# EAGLE design turntable_ir_5 (EAGLE 8.3.1)
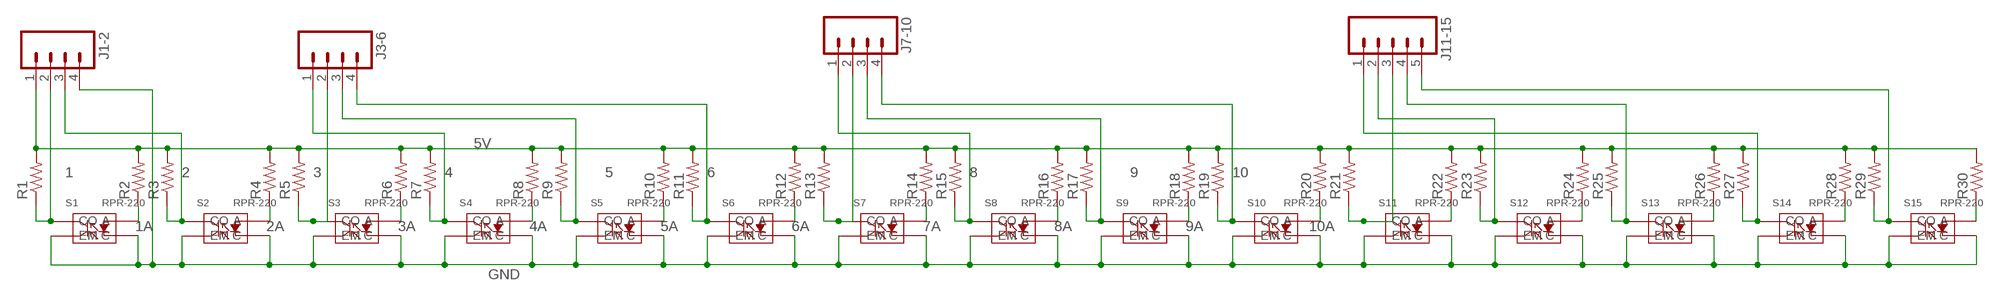
[diagram p0: schematic, sheet 1]

## Parts
J1-2  M04NO_SILK_ALL_ROUND  [1X04_NO_SILK_ALL_ROUND]
J3-6  M04NO_SILK_ALL_ROUND  [1X04_NO_SILK_ALL_ROUND]
J7-10  M04NO_SILK_ALL_ROUND  [1X04_NO_SILK_ALL_ROUND]
J11-15  M05NO_SILK  [1X05_NO_SILK]
R1  RESISTOR1206  [1206]
R2  RESISTOR1206  [1206]
R3  RESISTOR1206  [1206]
R4  RESISTOR1206  [1206]
R5  RESISTOR1206  [1206]
R6  RESISTOR1206  [1206]
R7  RESISTOR1206  [1206]
R8  RESISTOR1206  [1206]
R9  RESISTOR1206  [1206]
R10  RESISTOR1206  [1206]
R11  RESISTOR1206  [1206]
R12  RESISTOR1206  [1206]
R13  RESISTOR1206  [1206]
R14  RESISTOR1206  [1206]
R15  RESISTOR1206  [1206]
R16  RESISTOR1206  [1206]
R17  RESISTOR1206  [1206]
R18  RESISTOR1206  [1206]
R19  RESISTOR1206  [1206]
R20  RESISTOR1206  [1206]
R21  RESISTOR1206  [1206]
R22  RESISTOR1206  [1206]
R23  RESISTOR1206  [1206]
R24  RESISTOR1206  [1206]
R25  RESISTOR1206  [1206]
R26  RESISTOR1206  [1206]
R27  RESISTOR1206  [1206]
R28  RESISTOR1206  [1206]
R29  RESISTOR1206  [1206]
R30  RESISTOR1206  [1206]
S1  RPR-220  [RPR-220-6.4X4.9X6.5]
S2  RPR-220  [RPR-220-6.4X4.9X6.5]
S3  RPR-220  [RPR-220-6.4X4.9X6.5]
S4  RPR-220  [RPR-220-6.4X4.9X6.5]
S5  RPR-220  [RPR-220-6.4X4.9X6.5]
S6  RPR-220  [RPR-220-6.4X4.9X6.5]
S7  RPR-220  [RPR-220-6.4X4.9X6.5]
S8  RPR-220  [RPR-220-6.4X4.9X6.5]
S9  RPR-220  [RPR-220-6.4X4.9X6.5]
S10  RPR-220  [RPR-220-6.4X4.9X6.5]
S11  RPR-220  [RPR-220-6.4X4.9X6.5]
S12  RPR-220  [RPR-220-6.4X4.9X6.5]
S13  RPR-220  [RPR-220-6.4X4.9X6.5]
S14  RPR-220  [RPR-220-6.4X4.9X6.5]
S15  RPR-220  [RPR-220-6.4X4.9X6.5]

## Nets
1: J1-2.2 R1.1 S1.P$4(CO)
1A: R2.1 S1.P$1(A)
2: J1-2.3 R3.1 S2.P$4(CO)
2A: R4.1 S2.P$1(A)
3: J3-6.2 R5.1 S3.P$4(CO)
3A: R6.1 S3.P$1(A)
4: J3-6.1 R7.1 S4.P$4(CO)
4A: R8.1 S4.P$1(A)
5: J3-6.3 R9.1 S5.P$4(CO)
5A: R10.1 S5.P$1(A)
5V: J1-2.1 R1.2 R2.2 R3.2 R4.2 R5.2 R6.2 R7.2 R8.2 R9.2 R10.2 R11.2 R12.2 R13.2 R14.2 R15.2 R16.2 R17.2 R18.2 R19.2 R20.2 R21.2 R22.2 R23.2 R24.2 R25.2 R26.2 R27.2 R28.2 R29.2 R30.2
6: J3-6.4 R11.1 S6.P$4(CO)
6A: R12.1 S6.P$1(A)
7: J7-10.2 R13.1 S7.P$4(CO)
7A: R14.1 S7.P$1(A)
8: J7-10.1 R15.1 S8.P$4(CO)
8A: R16.1 S8.P$1(A)
9: J7-10.3 R17.1 S9.P$4(CO)
9A: R18.1 S9.P$1(A)
10: J7-10.4 R19.1 S10.P$4(CO)
10A: R20.1 S10.P$1(A)
11: J11-15.3 R21.1 S11.P$4(CO)
11A: R22.1 S11.P$1(A)
12: J11-15.2 R23.1 S12.P$4(CO)
12A: R24.1 S12.P$1(A)
13: J11-15.4 R25.1 S13.P$4(CO)
13A: R26.1 S13.P$1(A)
14: J11-15.1 R27.1 S14.P$4(CO)
14A: R28.1 S14.P$1(A)
15: J11-15.5 R29.1 S15.P$4(CO)
15A: R30.1 S15.P$1(A)
GND: J1-2.4 S1.P$2(C) S1.P$3(EM) S2.P$2(C) S2.P$3(EM) S3.P$2(C) S3.P$3(EM) S4.P$2(C) S4.P$3(EM) S5.P$2(C) S5.P$3(EM) S6.P$2(C) S6.P$3(EM) S7.P$2(C) S7.P$3(EM) S8.P$2(C) S8.P$3(EM) S9.P$2(C) S9.P$3(EM) S10.P$2(C) S10.P$3(EM) S11.P$2(C) S11.P$3(EM) S12.P$2(C) S12.P$3(EM) S13.P$2(C) S13.P$3(EM) S14.P$2(C) S14.P$3(EM) S15.P$2(C) S15.P$3(EM)

## Library data of the parts
J1-2 J3-6 J7-10 = SparkFun-Connectors:M04: Header 4 Standard 4-pin 0.1" header. Use with straight break away headers (SKU : PRT-00116), right angle break away headers (PRT-00553), swiss pins (PRT-00743), machine pins (PRT-00117), and female headers (PRT-00115). Molex polarized connector foot print use with SKU : PRT-08231 with associated crimp pins and housings. 1MM SMD Version SKU: PRT-10208; PROD_ID: CONN-09696
J11-15 = SparkFun-Connectors:M05: Header 5 Standard 5-pin 0.1" header. Use with straight break away headers (SKU : PRT-00116), right angle break away headers (PRT-00553), swiss pins (PRT-00743), machine pins (PRT-00117), and female headers (PRT-00115). Molex polarized connector foot print use with SKU : PRT-08230 with associated crimp pins and housings.
R1-R30 = SparkFun-Resistors:RESISTOR: Resistor Basic schematic elements and footprints for 0603, 1206, and PTH resistors.
S1-S15 = rpr-220:RPR-220: 314020002

## Net classes
0 default: clearance 0.205 mm

## Board
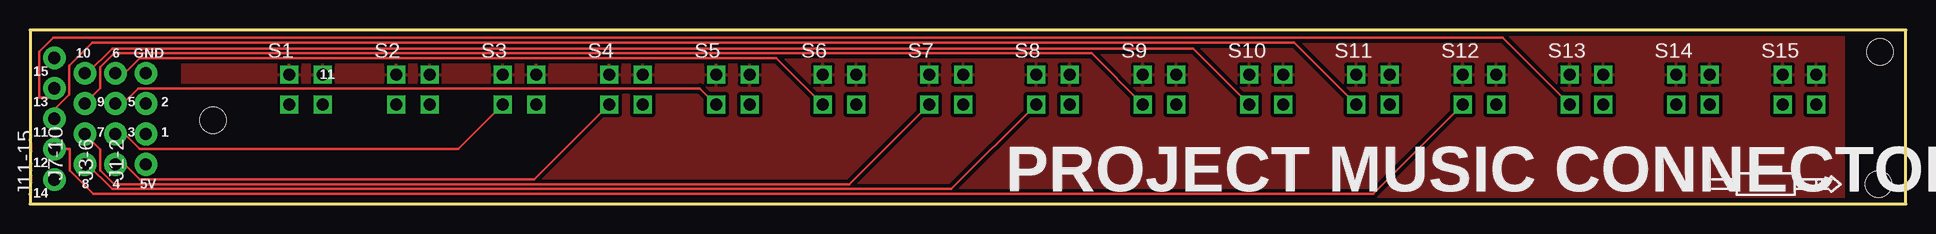
[diagram p1: board, top side]
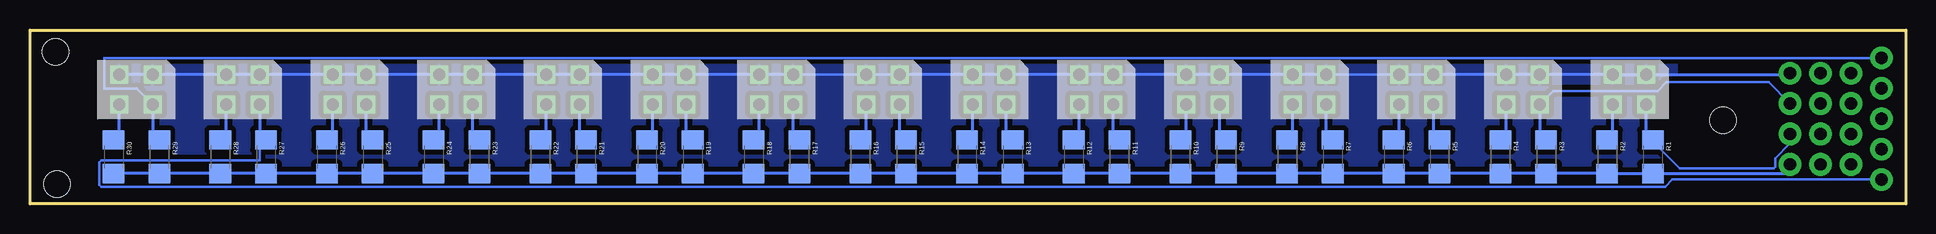
[diagram p2: board, bottom side, seen from below]

Size 156.32 x 14.53 mm. Coordinates in mm from the lower left corner, seen from the top.
Outline: 0,0 156.32,0 156.32,14.53 0,14.53 0,0
Copper layers (1*16): Top 0.035559375mm / dielectric 1.6mm / Bottom 0.035559375mm
Design rules "oshpark-2layer": minimum track width 6mil, minimum drill 10mil, track to track 6mil, track to pad 6mil, pad to pad 6mil, via to via 6mil, smd to smd 6mil, copper to edge 15mil, drill to drill 6mil, minimum pad ring 5mil, minimum via ring 5mil, stop-mask expansion 2.5mil, vias tented up to drill 0mil, thermal gap 10mil
Holes 2.2 mm at 15.24,6.99 154.05,1.65 154.18,12.7

### Footprints (pad centres in the part's own frame; a part is rotated, then mirrored left to right if it is on the bottom)
1X04_NO_SILK_ALL_ROUND = drill 1.016 pad 1.88: 1 0,0; 2 2.54,0; 3 5.08,0; 4 7.62,0
1X05_NO_SILK = drill 1.016 pad 1.88: 1 0,0; 2 2.54,0; 3 5.08,0; 4 7.62,0; 5 10.16,0
1206 = smd 1.6 x 1.8: 1 -1.4,0; 2 1.4,0
RPR-220-6.4X4.9X6.5 = drill 1 square: P$1 4.601,1.2; P$2 4.601,3.7; P$3 1.801,3.7; P$4 1.801,1.2

### Placement (x,y rotation side)
J1-2  9.65,3.3 90 top
J3-6  7.11,3.3 90 top
J7-10  4.57,3.3 90 top
J11-15  2.03,2.03 90 top
R1  21.08,3.94 270 bottom
R2  24.89,3.94 270 bottom
R3  29.97,3.94 270 bottom
R4  33.78,3.94 270 bottom
R5  38.86,3.94 270 bottom
R6  42.67,3.94 270 bottom
R7  47.75,3.94 270 bottom
R8  51.56,3.94 270 bottom
R9  56.64,3.94 270 bottom
R10  60.45,3.94 270 bottom
R11  65.53,3.94 270 bottom
R12  69.34,3.94 270 bottom
R13  74.42,3.94 270 bottom
R14  78.23,3.94 270 bottom
R15  83.31,3.94 270 bottom
R16  87.12,3.94 270 bottom
R17  92.2,3.94 270 bottom
R18  96.01,3.94 270 bottom
R19  101.09,3.94 270 bottom
R20  104.9,3.94 270 bottom
R21  109.98,3.94 270 bottom
R22  113.79,3.94 270 bottom
R23  118.87,3.94 270 bottom
R24  122.68,3.94 270 bottom
R25  127.76,3.94 270 bottom
R26  131.57,3.94 270 bottom
R27  136.65,3.94 270 bottom
R28  140.46,3.94 270 bottom
R29  145.54,3.94 270 bottom
R30  149.35,3.94 270 bottom
S1  19.81,7.11 0 top
S2  28.7,7.11 0 top
S3  37.59,7.11 0 top
S4  46.48,7.11 0 top
S5  55.37,7.11 0 top
S6  64.26,7.11 0 top
S7  73.15,7.11 0 top
S8  82.04,7.11 0 top
S9  90.93,7.11 0 top
S10  99.82,7.11 0 top
S11  108.71,7.11 0 top
S12  117.6,7.11 0 top
S13  126.49,7.11 0 top
S14  135.38,7.11 0 top
S15  144.27,7.11 0 top

### Tracks (layer width: path | path; a pad name or v marks a point on that pad's centre or on a via)
1
  Bottom 0.203: 20.94,5.84 21.08,5.7 | J1-2.2 9.65,5.07 10.9,3.82 10.9,3.07 11,2.97 18.84,2.97 21.21,5.34
  Bottom 0.254: S1.P$4 21.61,5.34 21.21,5.34 R1.1 21.08,5.7 21.08,5.84
1A
  Bottom 0.254: R2.1 24.41,5.34 S1.P$1
2
  Bottom 0.203: S2.P$4 29.39,9.42 20.68,9.42 19.94,10.16 11.43,10.16 J1-2.3
  Bottom 0.254: R3.1 30.5,5.34 S2.P$4
2A
  Bottom 0.254: R4.1 33.3,5.34 S2.P$1
3
  Top 0.203: J3-6.2 7.89,5.84 9.14,4.6 35.68,4.6 S3.P$4
  Bottom 0.254: R5.1 39.39,5.34 S3.P$4
3A
  Bottom 0.254: R6.1 42.19,5.34 S3.P$1
4
  Top 0.203: J3-6.1 7.89,3.3 9.14,2.06 42.03,2.06 S4.P$4
  Bottom 0.254: R7.1 48.28,5.34 S4.P$4
4A
  Bottom 0.254: R8.1 51.08,5.34 S4.P$1
5
  Top 0.203: J3-6.3 7.75,8.38 9.02,9.65 55.83,9.65 S5.P$4
  Bottom 0.254: R9.1 57.17,5.34 S5.P$4
5A
  Bottom 0.254: R10.1 59.97,5.34 S5.P$1
5V
  Bottom 0.254: R30.2 R29.2 R28.2 R27.2 R26.2 R25.2 R24.2 R23.2 R22.2 R21.2 R20.2 R19.2 R18.2 R17.2 R16.2 R15.2 R14.2 R13.2 R12.2 R11.2 R10.2 R9.2 R8.2 R7.2 R6.2 R5.2 R4.2 R3.2 R2.2 R1.2 9.65,2.54 J1-2.1
6
  Top 0.203: J3-6.4 7.89,10.92 9.14,12.17 62.21,12.17 S6.P$4
  Bottom 0.254: R11.1 66.06,5.34 S6.P$4
6A
  Bottom 0.254: R12.1 68.86,5.34 S6.P$1
7
  Top 0.203: S7.P$4 68.29,1.65 7,1.65 5.87,2.79 5.87,4.55 J7-10.2
  Bottom 0.254: R13.1 74.95,5.34 S7.P$4
7A
  Bottom 0.254: R14.1 77.75,5.34 S7.P$1
8
  Top 0.203: 5.35,3.3 J7-10.1 4.77,3.3 6.83,1.24 76.77,1.24 S8.P$4
  Bottom 0.254: R15.1 83.84,5.34 S8.P$4
8A
  Bottom 0.254: R16.1 86.64,5.34 S8.P$1
9
  Top 0.203: J7-10.3 5.87,9.68 5.87,11.44 7,12.58 88.47,12.58 S9.P$4
  Bottom 0.254: R17.1 92.73,5.34 S9.P$4
9A
  Bottom 0.254: R18.1 95.53,5.34 S9.P$1
10
  Top 0.203: J7-10.4 4.77,10.92 6.83,12.98 96.95,12.98 S10.P$4
  Bottom 0.254: R19.1 101.62,5.34 S10.P$4
10A
  Bottom 0.254: R20.1 104.42,5.34 S10.P$1
11
  Top 0.203: J11-15.3 2.03,7.89 3.28,9.14 3.28,11.53 5.21,13.46 105.36,13.46 S11.P$4
  Bottom 0.254: R21.1 110.51,5.34 S11.P$4
11A
  Bottom 0.254: R22.1 113.31,5.34 S11.P$1
12
  Top 0.203: S12.P$4 111.92,0.83 5.28,0.83 3.33,2.79 3.33,4.57 J11-15.2
  Bottom 0.254: R23.1 119.4,5.34 S12.P$4
12A
  Bottom 0.254: R24.1 122.2,5.34 S12.P$1
13
  Top 0.203: J11-15.4 2.03,8.88 0.79,8.88 0.79,12.71 1.95,13.87 122.73,13.87 S13.P$4
  Bottom 0.254: R25.1 128.29,5.34 S13.P$4
13A
  Bottom 0.254: R26.1 131.09,5.34 S13.P$1
14
  Bottom 0.203: J11-15.1 19.45,2.03 20.05,1.43 150.38,1.43 150.56,1.61 150.56,3.46 150.38,3.64 137.18,3.64 S14.P$4
  Bottom 0.254: R27.1 137.18,5.34 S14.P$4
14A
  Bottom 0.254: R28.1 139.98,5.34 S14.P$1
15
  Bottom 0.203: S15.P$4 147.41,9.65 150.11,9.65 150.11,12.19 J11-15.5
  Bottom 0.254: R29.1 146.07,5.34 S15.P$4
15A
  Bottom 0.254: R30.1 148.87,5.34 S15.P$1
GND
  Bottom 0.203: S8.P$3 S8.P$2 S9.P$3 | S3.P$3 S3.P$2 S4.P$3
  Bottom 0.254: S3.P$3 S2.P$2 S2.P$3 S1.P$2 S1.P$3 9.65,10.81 J1-2.4 | S4.P$3 S4.P$2 S5.P$3 S5.P$2 S6.P$3 S6.P$2 S7.P$3 S7.P$2 S8.P$3 | S9.P$3 S9.P$2 S10.P$3 S10.P$2 S11.P$3 S11.P$2 S12.P$3 S12.P$2 S13.P$3 S13.P$2 S14.P$3 S14.P$2 S15.P$3 S15.P$2
  pour Top (isolate 0.305): 12.7,0 12.7,14.48 151.13,14.48 151.13,0
  pour Bottom (isolate 0.406): 19.05,0 19.05,14.48 151.13,14.48 151.13,0

### Text on the board
tPlace: 10 | 6 | GND | 15 | 11 | 13 | 9 | 5 | 2 | 11 | 7 | 3 | 1 | 12 | 14 | 8 | 4 | 5V | PROJECT MUSIC CONNECTOR